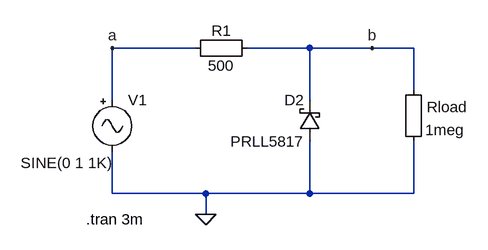
[diagram p0: schematic LD-N5.asc]
LD-N5.asc, the LTspice schematic file:
Version 4
SHEET 1 880 680
WIRE 32 144 -96 144
WIRE 208 144 112 144
WIRE 304 144 208 144
WIRE 368 144 304 144
WIRE 368 208 368 144
WIRE -96 224 -96 144
WIRE 208 224 208 144
WIRE -96 368 -96 304
WIRE 48 368 -96 368
WIRE 208 368 208 288
WIRE 208 368 48 368
WIRE 368 368 368 288
WIRE 368 368 208 368
WIRE 48 400 48 368
FLAG -96 144 a
FLAG 304 144 b
FLAG 48 400 0
SYMBOL Misc\\signal -96 208 R0
WINDOW 123 0 0 Left 2
WINDOW 39 0 0 Left 2
WINDOW 3 -141 113 Left 2
SYMATTR InstName V1
SYMBOL Misc\\EuropeanResistor 128 128 R90
WINDOW 0 5 56 VBottom 2
WINDOW 3 27 56 VTop 2
SYMATTR InstName R1
SYMATTR Value 500
SYMBOL schottky 224 288 R180
WINDOW 3 24 0 Left 2
WINDOW 0 24 64 Left 2
SYMATTR Value PRLL5817
SYMATTR InstName D2
SYMATTR Description Diode
SYMATTR Type diode
SYMBOL Misc\\EuropeanResistor 384 304 R180
WINDOW 0 -67 69 Left 2
WINDOW 3 -63 34 Left 2
SYMATTR InstName Rload
SYMATTR Value 1meg
TEXT -136 408 Left 2 !.tran 3m

The netlist it stands for:
* LD-N5.asc
V1 a 0 SINE(0 1 1K)
R1 b a 500
D2 0 b PRLL5817
Rload 0 b 1meg
.model D D
.lib standard.dio
.tran 3m
.backanno
.end